# EAGLE design ardustatversion10 (EAGLE 6.1)
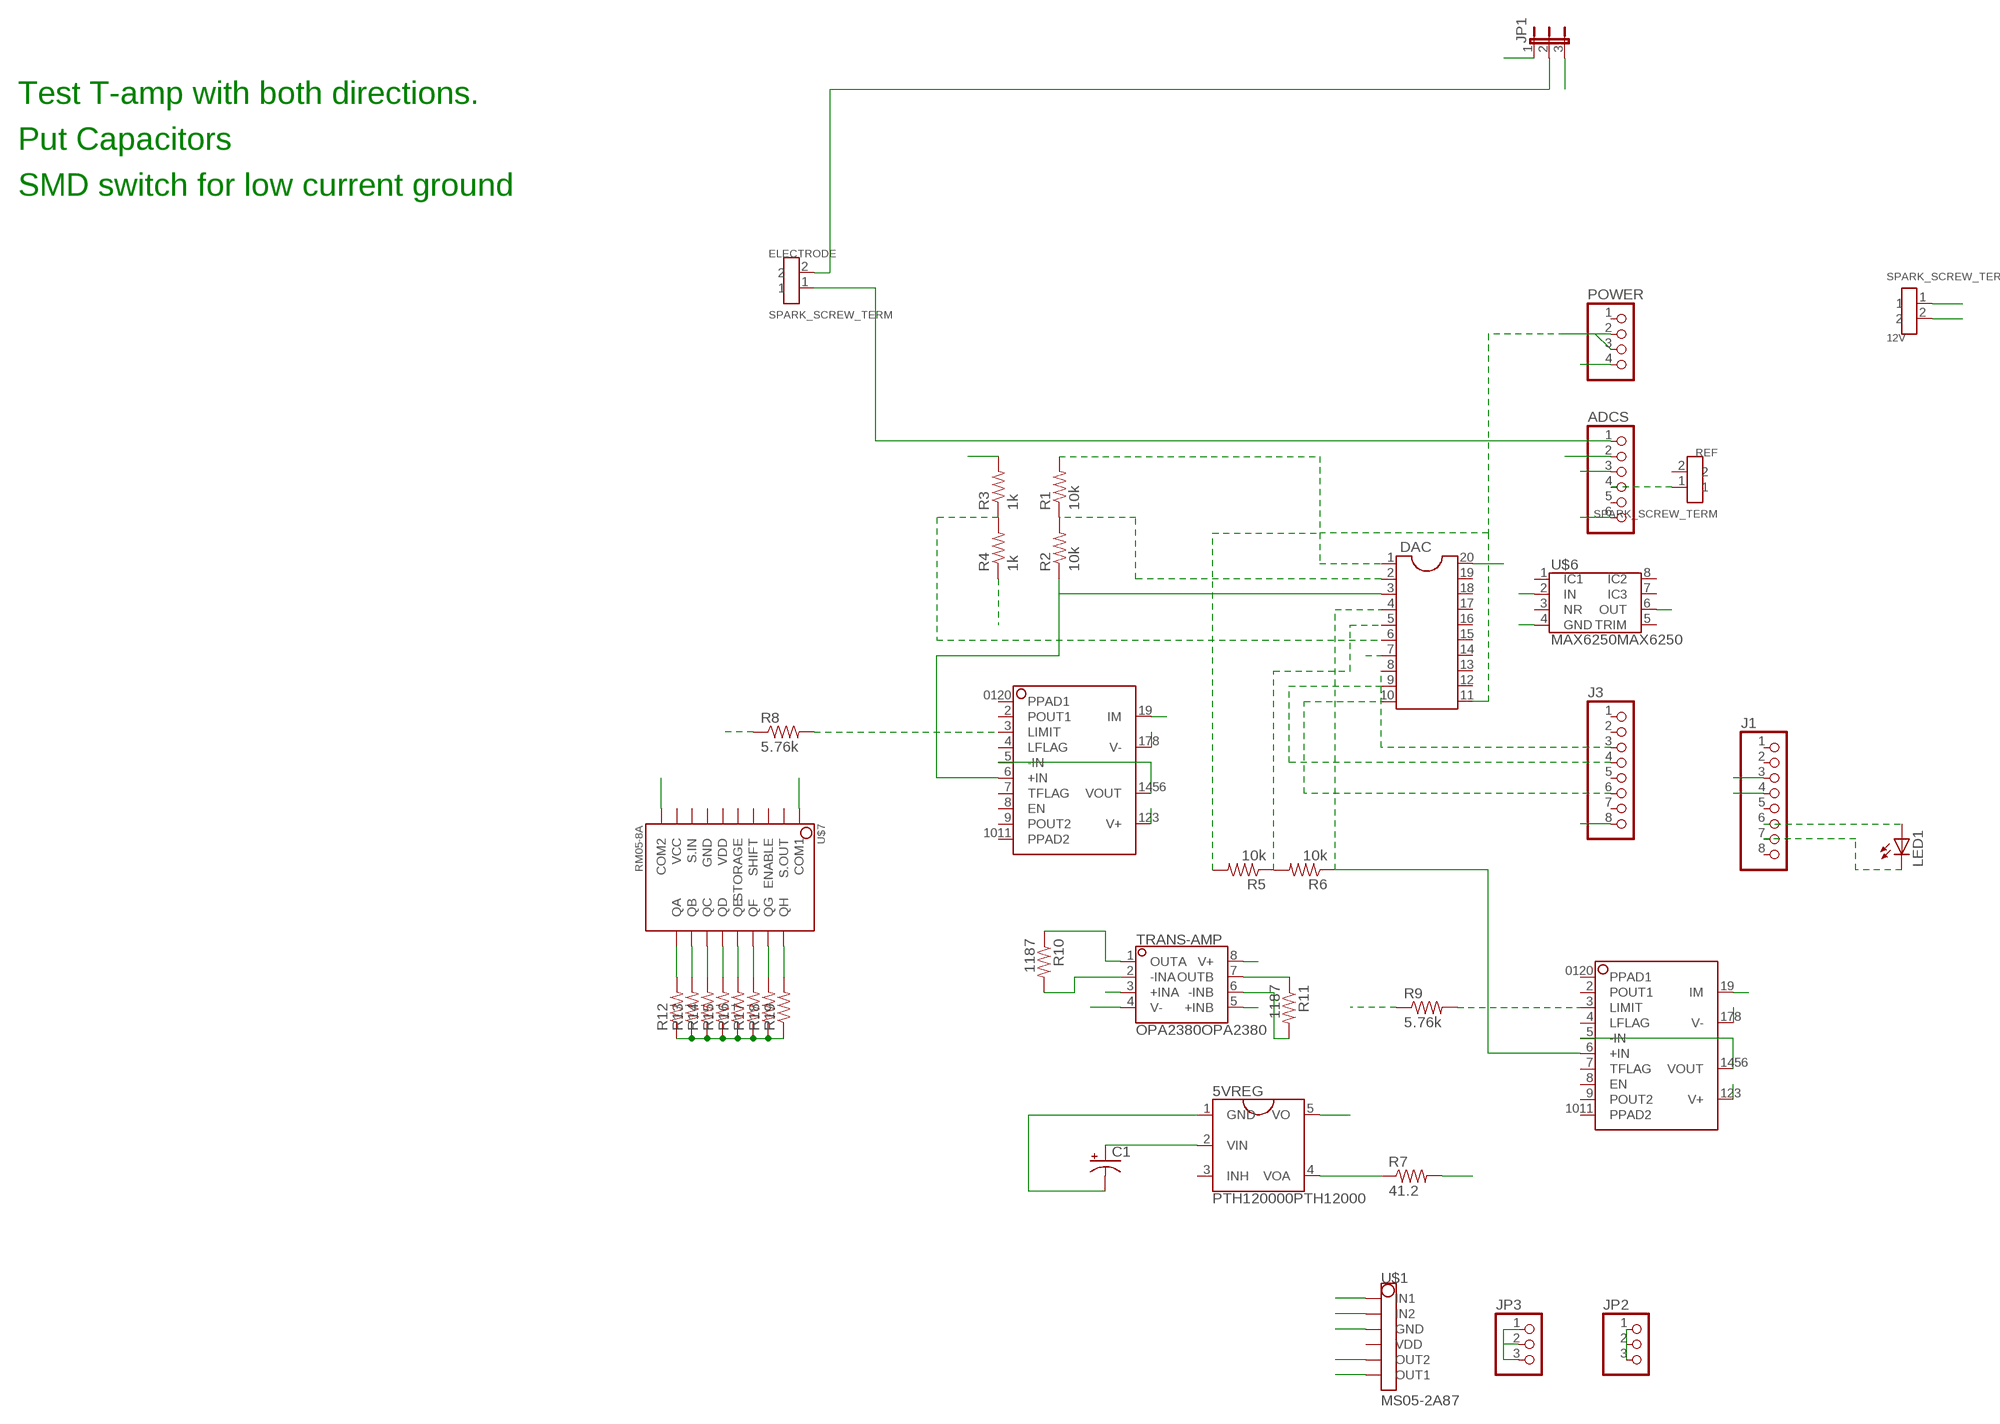
[diagram p0: schematic, sheet 1]

## Parts
5VREG  PTH120000PTH12000  [PTH120000]
12V  SPARK_SCREW_TERM  [SPARK_SCREW_TERM]
ADCS  PINHD-1X6  [1X06]
C1  CPOL-USE5-10.5  [E5-10,5]
DAC  DIL20S  [SOCKED-20]
ELECTRODE  SPARK_SCREW_TERM  [SPARK_SCREW_TERM]
J1  PINHD-1X8  [1X08]
J3  PINHD-1X8  [1X08]
JP1  JP2E  [JP2]
JP2  PINHD-1X3  [1X03]
JP3  PINHD-1X3  [1X03]
LED1  LED5MM  [LED5MM]
POWER  PINHD-1X4  [1X04]
R1  10k  R-US_R1206  [R1206]
R2  10k  R-US_R1206  [R1206]
R3  1k  R-US_R1206  [R1206]
R4  1k  R-US_R1206  [R1206]
R5  10k  R-US_R1206  [R1206]
R6  10k  R-US_R1206  [R1206]
R7  41.2  R-US_M1206  [M1206]
R8  5.76k  R-US_R1206  [R1206]
R9  5.76k  R-US_M1206  [M1206]
R10  1187  R-US_M1206  [M1206]
R11  1187  R-US_M1206  [M1206]
R12  R-US_0207/12  [0207/12]
R13  R-US_0207/12  [0207/12]
R14  R-US_0207/12  [0207/12]
R15  R-US_0207/12  [0207/12]
R16  R-US_0207/12  [0207/12]
R17  R-US_0207/12  [0207/12]
R18  R-US_0207/12  [0207/12]
R19  R-US_0207/12  [0207/12]
REF  SPARK_SCREW_TERM  [SPARK_SCREW_TERM]
TRANS-AMP  OPA2380OPA2380  [OPA2380]
U$1  MS05-2A87  [MS05-2A87]
U$3  OPA569OPA569  [OPA569]
U$4  OPA569OPA569  [OPA569]
U$6  MAX6250MAX6250  [MAX6250]
U$7  RM05-8A  [RM05-8A]

## Nets
GND: 5VREG.1(GND) 12V.2 C1.- DAC.1 DAC.11 JP1.3 POWER.2 POWER.3 R1.2 R4.1 R5.2 R7.2 R8.1 R9.1 TRANS-AMP.4(V-) U$1.P$3(GND) U$3.178(V-) U$4.178(V-) U$6.4(GND)
N$1: DAC.6 R3.1 R4.2
N$2: DAC.10 J3.6
N$3: DAC.9 J3.4
N$4: DAC.8 J3.3
N$5: DAC.7 J1.3
N$6: J1.4
N$7: DAC.2 R1.1 R2.2
N$8: ADCS.1 ELECTRODE.1 JP2.1 JP2.2 JP2.3 R12.1 R13.1 R14.1 R15.1 R16.1 R17.1 R18.1 R19.1
N$9: U$1.P$2(IN2) U$4.5(-IN) U$4.1456(VOUT)
N$10: R10.2 TRANS-AMP.2(-INA) U$3.19(IM)
N$11: R12.2 U$7.P$11(QA)
N$12: DAC.5 R5.1 R6.2
N$13: R8.2 U$3.3(LIMIT)
N$14: R10.1 TRANS-AMP.1(OUTA)
N$15: ADCS.2 DAC.3 R2.1 U$3.6(+IN) U$7.P$1(COM1) U$7.P$10(COM2)
N$16: R9.2 U$4.3(LIMIT)
N$17: J1.6 LED1.A
N$18: J1.7 LED1.K(C)
N$19: 5VREG.5(VO) DAC.20 TRANS-AMP.8(V+) U$3.123(V+) U$4.123(V+)
N$20: ADCS.4 REF.1
N$21: ADCS.3 ELECTRODE.2 JP1.2
N$22: 5VREG.2(VIN) 12V.1 C1.+ POWER.4 U$6.2(IN)
N$23: JP3.1 JP3.2 JP3.3 U$1.P$6(OUT1)
N$24: J3.8 R3.2 TRANS-AMP.3(+INA) TRANS-AMP.5(+INB) U$6.6(OUT)
N$25: 5VREG.4(VOA) R7.1
N$26: U$1.P$1(IN1) U$3.5(-IN) U$3.1456(VOUT)
N$27: R13.2 U$7.P$12(QB)
N$28: R14.2 U$7.P$13(QC)
N$30: R15.2 U$7.P$14(QD)
N$31: R16.2 U$7.P$15(QE)
N$32: DAC.4 R6.1 U$4.6(+IN)
N$33: R17.2 U$7.P$16(QF)
N$34: R18.2 U$7.P$17(QG)
N$35: R19.2 U$7.P$18(QH)
N$36: JP1.1 U$1.P$5(OUT2)
N$48: ADCS.6 R11.1 TRANS-AMP.7(OUTB)
N$49: R11.2 TRANS-AMP.6(-INB) U$4.19(IM)
Unconnected: 5VREG.3(INH) ADCS.5 DAC.12 DAC.13 DAC.14 DAC.15 DAC.16 DAC.17 DAC.18 DAC.19 J1.1 J1.2 J1.5 J1.8 J3.1 J3.2 J3.5 J3.7 POWER.1 REF.2 U$1.P$4(VDD) U$3.2(POUT1) U$3.4(LFLAG) U$3.7(TFLAG) U$3.8(EN) U$3.9(POUT2) U$3.0120(PPAD1) U$3.1011(PPAD2) U$4.2(POUT1) U$4.4(LFLAG) U$4.7(TFLAG) U$4.8(EN) U$4.9(POUT2) U$4.0120(PPAD1) U$4.1011(PPAD2) U$6.1(IC1) U$6.3(NR) U$6.5(TRIM) U$6.7(IC3) U$6.8(IC2) U$7.P$2(S.OUT) U$7.P$3(ENABLE) U$7.P$4(SHIFT) U$7.P$5(STORAGE) U$7.P$6(VDD) U$7.P$7(GND) U$7.P$8(S.IN) U$7.P$9(VCC)

## Notes on the sheet
- Test T-amp with both directions.
- Put Capacitors
- SMD switch for low current ground

## Library data of the parts
5VREG = ardustat:PTH120000
12V ELECTRODE REF = ardustat:SPARK_SCREW_TERM
ADCS = pinhead:PINHD-1X6: PIN HEADER
C1 = rcl:CPOL-US: POLARIZED CAPACITOR, American symbol
DAC = ic-package:DIL20: Dual In Line
J1 J3 = pinhead:PINHD-1X8: PIN HEADER
JP1 = jumper:JP2E: JUMPER
JP2 JP3 = pinhead:PINHD-1X3: PIN HEADER
LED1 = led:LED: LED OSRAM: - CHIPLED LG R971, LG N971, LY N971, LG Q971, LY Q971, LO R971, LY R971 LH N974, LH R974 LS Q976, LO Q976, LY Q976 LO Q996 - Hyper CHIPLED LW Q18S LB Q993, LB Q99A, LB R99A - SideLED LS A670, LO A670, LY A670, LG A670, LP A670 LB A673, LV A673, LT A673, LW A673 LH A674 LY A675 LS A676, LA A676, LO A676, LY A676, LW A676 LS A679, LY A679, LG A679 - Hyper Micro SIDELED® LS Y876, LA Y876, LO Y876, LY Y876 LT Y87S - SmartLED LW L88C, LW L88S LB L89C, LB L89S, LG L890 LS L89K, LO L89K, LY L89K LS L896, LA L896, LO L896, LY L896 - TOPLED LS T670, LO T670, LY T670, LG T670, LP T670 LSG T670, LSP T670, LSY T670, LOP T670, LYG T670 LG T671, LOG T671, LSG T671 LB T673, LV T673, LT T673, LW T673 LH T674 LS T676, LA T676, LO T676, LY T676, LB T676, LH T676, LSB T676, LW T676 LB T67C, LV T67C, LT T67C, LS T67K, LO T67K, LY T67K, LW E67C LS E67B, LA E67B, LO E67B, LY E67B, LB E67C, LV E67C, LT E67C LW T67C LS T679, LY T679, LG T679 LS T770, LO T770, LY T770, LG T770, LP T770 LB T773, LV T773, LT T773, LW T773 LH T774 LS E675, LA E675, LY E675, LS T675 LS T776, LA T776, LO T776, LY T776, LB T776 LHGB T686 LT T68C, LB T68C - Hyper Mini TOPLED® LB M676 - Mini TOPLED Santana® LG M470 LS M47K, LO M47K, LY M47K Source: http://www.osram.convergy.de - LUMILED® LXK2-PW12-R00, LXK2-PW12-S00, LXK2-PW14-U00, LXK2-PW14-V00 LXK2-PM12-R00, LXK2-PM12-S00, LXK2-PM14-U00 LXK2-PE12-Q00, LXK2-PE12-R00, LXK2-PE12-S00, LXK2-PE14-T00, LXK2-PE14-U00 LXK2-PB12-K00, LXK2-PB12-L00, LXK2-PB12-M00, LXK2-PB14-N00, LXK2-PB14-P00, LXK2-PB14-Q00 LXK2-PR12-L00, LXK2-PR12-M00, LXK2-PR14-Q00, LXK2-PR14-R00 LXK2-PD12-Q00, LXK2-PD12-R00, LXK2-PD12-S00 LXK2-PH12-R00, LXK2-PH12-S00 LXK2-PL12-P00, LXK2-PL12-Q00, LXK2-PL12-R00 Source: www.luxeon.com
POWER = pinhead:PINHD-1X4: PIN HEADER
R1 R3-R11 = rcl:R-US_: RESISTOR, American symbol
R2 R12-R19 = resistor:R-US_: RESISTOR, American symbol
TRANS-AMP = ardustat:OPA2380
U$1 = ardustat:MS05-2A87
U$3 U$4 = ardustat:OPA569
U$6 = ardustat:MAX6250
U$7 = ardustat:RM05-8A

## Board
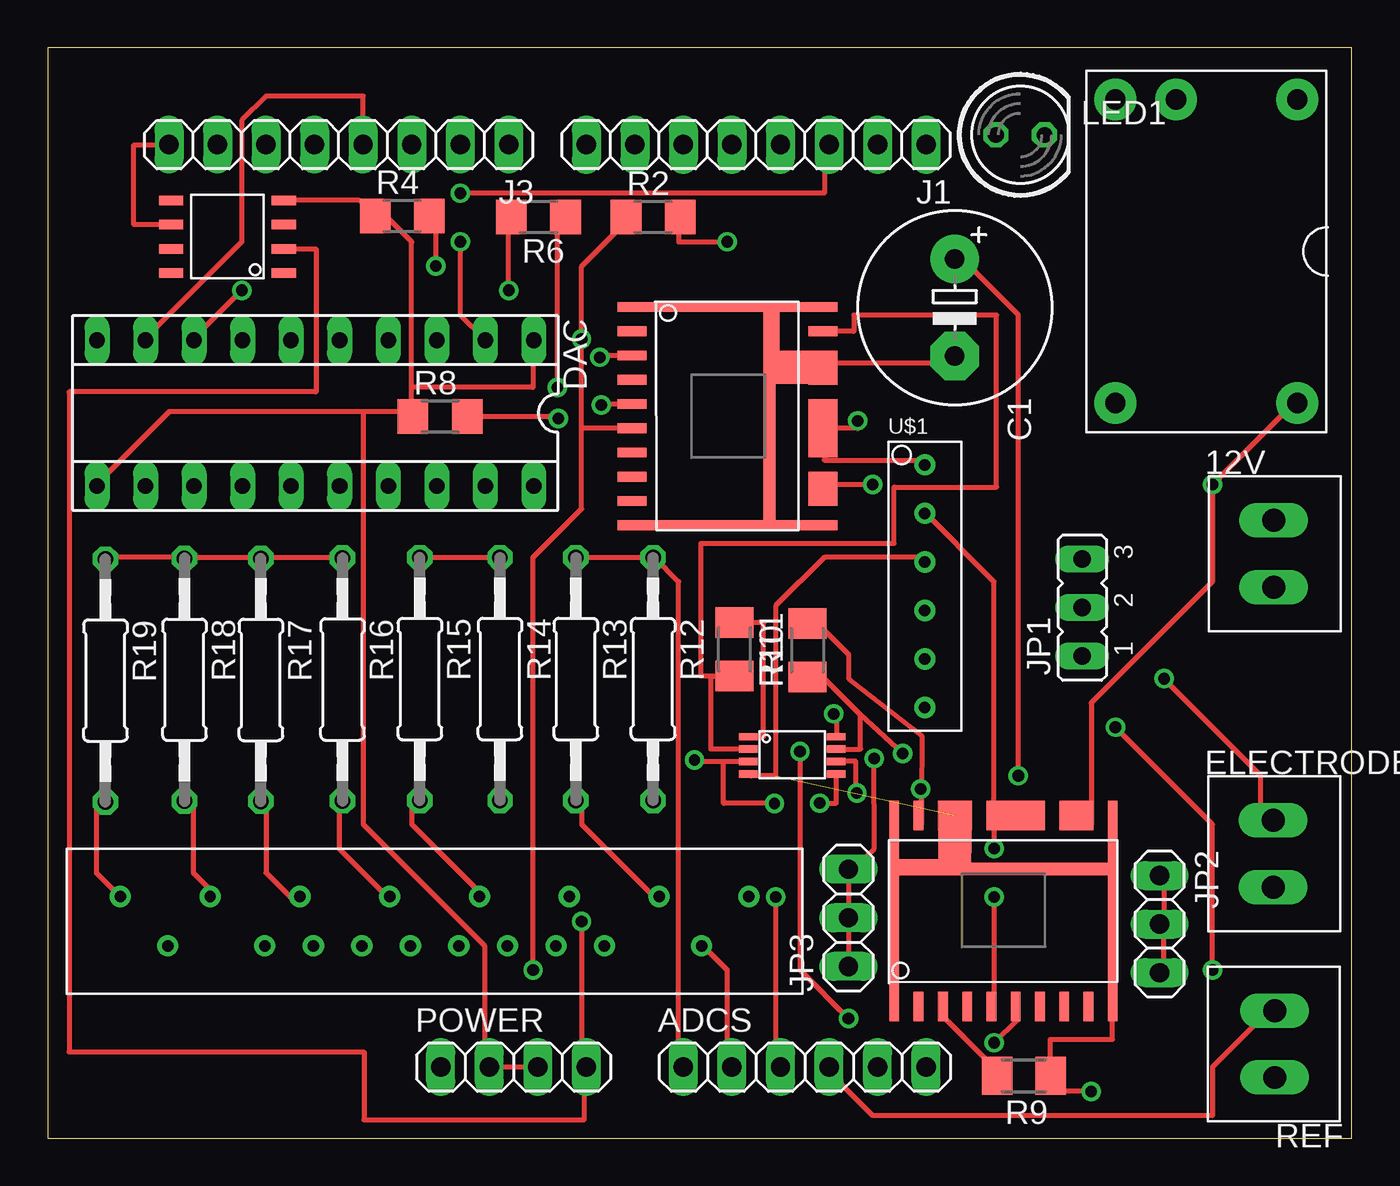
[diagram p1: board, top side]
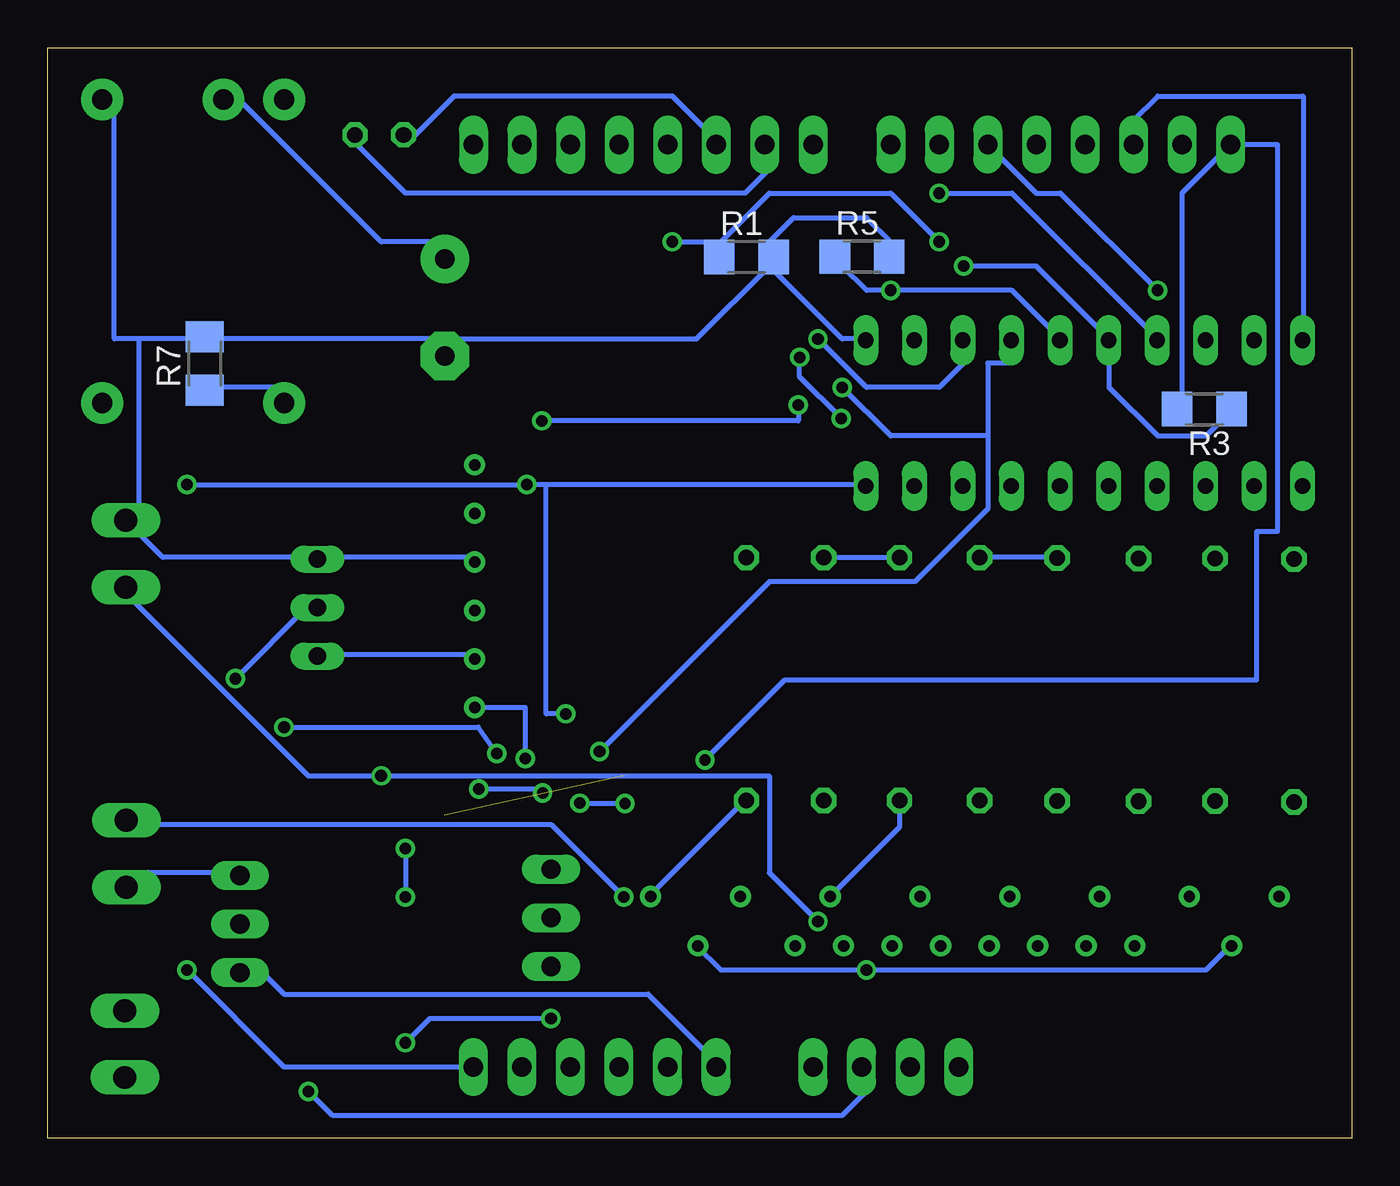
[diagram p2: board, bottom side, seen from below]

Size 68.25 x 57.05 mm. Coordinates in mm from the lower left corner, seen from the top.
Outline: 0,0 68.25,0 68.25,57.05 0,57.05 0,0
Copper layers (1*16): Top 0.035mm / dielectric 1.5mm / Bottom 0.035mm
Design rules: minimum track width 10mil, minimum drill 24mil, track to track 8mil, track to pad 8mil, pad to pad 8mil, via to via 8mil, smd to smd 8mil, copper to edge 40mil, drill to drill 8mil, minimum pad ring 10mil, minimum via ring 8mil, stop-mask expansion 4mil, vias tented up to drill 0mil, thermal gap 0mil

### Footprints (pad centres in the part's own frame; a part is rotated, then mirrored left to right if it is on the bottom)
PTH120000 = drill 1.06 pad 2.184: 1 -7.94,4.76; 2 -7.94,-1.59; 3 -7.94,-4.76; 4 7.94,-4.76; 5 7.94,4.76
SPARK_SCREW_TERM = drill 1.2 long: 1 0,-1.8; 2 0,1.7
1X06 = drill 1.016 long: 1 -6.35,0; 2 -3.81,0; 3 -1.27,0; 4 1.27,0; 5 3.81,0; 6 6.35,0
E5-10,5 = drill 1.016 pad 2.54: + -2.54,0 | drill 1.016 pad 2.54 octagon: - 2.54,0
SOCKED-20 = drill 0.813 long: 1 -11.43,-3.81; 2 -8.89,-3.81; 3 -6.35,-3.81; 4 -3.81,-3.81; 5 -1.27,-3.81; 6 1.27,-3.81; 7 3.81,-3.81; 8 6.35,-3.81; 9 8.89,-3.81; 10 11.43,-3.81; 11 11.43,3.81; 12 8.89,3.81; 13 6.35,3.81; 14 3.81,3.81; 15 1.27,3.81; 16 -1.27,3.81; 17 -3.81,3.81; 18 -6.35,3.81; 19 -8.89,3.81; 20 -11.43,3.81
1X08 = drill 1.016 long: 1 -8.89,0; 2 -6.35,0; 3 -3.81,0; 4 -1.27,0; 5 1.27,0; 6 3.81,0; 7 6.35,0; 8 8.89,0
JP2 = drill 0.914 long: 1 -2.54,0; 2 0,0; 3 2.54,0
1X03 = drill 1.016 long: 1 -2.54,0; 2 0,0; 3 2.54,0
LED5MM = drill 0.813 octagon: A -1.27,0; K 1.27,0
1X04 = drill 1.016 long: 1 -3.81,0; 2 -1.27,0; 3 1.27,0; 4 3.81,0
R1206 = smd 1.6 x 1.803: 1 -1.422,0; 2 1.422,0
M1206 = smd 1.6 x 2: 1 -1.4,0; 2 1.4,0
0207/12 = drill 0.813 octagon: 1 -6.35,0; 2 6.35,0
OPA2380 = smd 0.975 x 0.38: 1 -2.259,0.982; 2 -2.259,0.332; 3 -2.259,-0.318; 4 -2.259,-0.968; 5 2.351,-0.968; 6 2.351,-0.318; 7 2.351,0.332; 8 2.351,0.982
MS05-2A87 = drill 0.6: P$1 0,6.35; P$2 0,3.81; P$3 0,1.27; P$4 0,-1.27; P$5 0,-3.81; P$6 0,-6.35
OPA569 = smd 1.53 x 0.51: 2 -5,4.343; 3 -5,3.073; 4 -5,1.803; 5 -5,0.533; 6 -5,-0.737; 7 -5,-2.007; 8 -5,-3.277; 9 -5,-4.547; 19 5,4.343 | smd 11.53 x 0.51: 0120 0,5.613; 1011 0,-5.817 | smd 1.53 x 1.781: 123 5,-3.913; 178 5,2.438 | smd 1.53 x 3.051: 1456 5,-0.738 | smd 1.27 x 0.635: P$1 3.66,2.99; P$2 3.66,2.4; P$3 3.66,1.9; P$4 2.61,2.99; P$5 2.61,2.58; P$6 2.61,2.08; P$7 2.61,1.94; P$8 2.61,1.92 | smd 0.635 x 1.27: P$9 2.2,3.54; P$10 2.2,4.04; P$11 2.2,4.79; P$12 2.4,4.94; P$13 2.4,4.35; P$14 2.4,3.89; P$15 2.2,3.08; P$16 2.2,2.6; P$17 2.2,2.21; P$18 2.2,1.18; P$19 2.2,0.04; P$20 2.2,-1.03; P$21 2.2,-2.18; P$22 2.2,-3.36; P$23 2.2,-4.54; P$24 2.2,-5.28
MAX6250 = smd 1.27 x 0.49: 1 -3.012,1.903; 2 -3.012,0.633; 3 -3.012,-0.637; 4 -3.012,-1.907; 5 2.888,-1.907; 6 2.888,-0.637; 7 2.888,0.633; 8 2.888,1.903
RM05-8A = drill 0.6: P$1 -1.29,13.97; P$2 -1.29,8.89; P$3 -1.29,6.35; P$4 -1.29,3.81; P$5 -1.29,1.27; P$6 -1.29,-1.27; P$7 -1.29,-3.81; P$8 -1.29,-6.35; P$9 -1.29,-8.89; P$10 -1.29,-13.97; P$11 1.29,-16.45; P$12 1.29,-11.75; P$13 1.29,-7.05; P$14 1.29,-2.35; P$15 1.29,2.35; P$16 1.29,7.05; P$17 1.29,11.75; P$18 1.29,16.45

### Placement (x,y rotation side)
5VREG  60.64,46.4 270 top
12V  64.17,30.63 0 top
ADCS  39.62,3.72 0 top
C1  47.47,43.45 270 top
DAC  14.01,37.93 180 top
ELECTRODE  64.14,14.93 0 top
J1  37.08,51.97 180 top
J3  15.24,51.98 180 top
JP1  54.14,27.76 90 top
JP2  58.19,11.19 270 top
JP3  41.91,11.53 90 top
LED1  50.9,52.49 0 top
POWER  24.38,3.71 0 top
R1  31.68,46.1 0 bottom
R2  31.69,48.19 0 top
R3  7.72,38.14 180 bottom
R4  18.56,48.24 0 top
R5  25.63,46.11 0 bottom
R6  25.68,48.2 180 top
R7  60.03,40.53 90 bottom
R8  20.54,37.75 0 top
R9  51.1,3.26 180 top
R10  35.95,25.57 270 top
R11  39.76,25.52 90 top
R12  31.68,24.02 270 top
R13  27.64,24.01 270 top
R14  23.67,24.02 270 top
R15  19.47,24.01 270 top
R16  15.43,23.99 270 top
R17  11.15,23.97 270 top
R18  7.16,23.98 270 top
R19  3.02,23.94 270 top
REF  64.22,4.87 180 top
TRANS-AMP  38.92,20.02 0 top
U$1  45.91,28.87 0 top
U$3  35.58,37.87 0 top
U$4  49.92,11.88 90 top
U$6  9.35,47.16 180 top
U$7  20.25,11.35 90 top

### Tracks (layer width: path | path; a pad name or v marks a point on that pad's centre or on a via)
GND  (via drill 0.61)  (1 unrouted)
  Top 0.254: TRANS-AMP.4 36.83,18.96 38.1,18.96 38.1,27.85 40.64,30.39 45.72,30.39 U$1.P$3 | v54.61,2.45 52.07,2.45 R9.1 | 22.86,3.72 25.4,3.72 POWER.3 | 19.05,38.01 19.05,39.28 | 19.05,39.28 19.05,46.9 17.78,48.17 R4.1 16.32,49.06 U$6.4 | 19.05,38.01 16.51,38.01 | 16.51,38.01 6.35,38.01 2.54,34.2 DAC.11 | 19.05,38.01 R8.1 | U$3.178 40.64,40.55 46.99,40.55 C1.- | 19.05,39.28 25.4,39.28 25.4,40.55 DAC.1 | 22.86,3.72 22.86,10.07 16.51,16.42 16.51,38.01 | 22.86,3.72 POWER.2
  Bottom 0.254: U$1.P$3 45.72,30.39 53.34,30.39 JP1.3 54.61,30.39 62.23,30.39 63.5,31.66 12V.2 63.5,32.93 63.5,41.82 | v54.61,2.45 53.34,1.18 26.67,1.18 25.4,2.45 POWER.3 | 30.48,45.63 26.67,41.82 25.4,41.82 DAC.1 | R5.2 24.13,46.9 25.4,48.17 29.21,48.17 30.48,46.9 R1.2 30.48,45.63 | 63.5,41.82 60.96,41.82 R7.2 59.69,41.82 48.26,41.82 C1.- 46.99,41.82 34.29,41.82 30.48,45.63 | 63.5,41.82 64.77,41.82 64.77,54.52 5VREG.1
N$1  (via drill 0.61)
  Top 0.254: v20.32,45.63 20.32,48.17 R4.2
  Bottom 0.254: R3.1 6.35,38.01 7.62,36.74 10.16,36.74 12.7,39.28 12.7,40.55 DAC.6 12.7,41.82 16.51,45.63 v20.32,45.63
N$2
  Bottom 0.254: DAC.10 2.54,41.82 2.54,54.52 10.16,54.52 11.43,53.25 J3.6
N$3
  Top 0.254: DAC.9 5.08,41.82 10.16,46.9 10.16,53.25 11.43,54.52 16.51,54.52 16.51,53.25 J3.4
N$4  (via drill 0.61)
  Top 0.254: v10.16,44.36 7.62,41.82 DAC.8
  Bottom 0.254: v10.16,44.36 15.24,49.44 16.51,49.44 J3.3
N$5  (via drill 0.61)
  Top 0.254: v21.59,49.44 40.64,49.44 40.64,50.71 J1.3
  Bottom 0.254: v21.59,49.44 17.78,49.44 10.16,41.82 DAC.7
N$7  (via drill 0.61)
  Top 0.254: v35.56,46.9 33.02,46.9 33.02,48.17 R2.2 | v21.59,46.9 21.59,43.09 22.86,41.82 DAC.2
  Bottom 0.254: v35.56,46.9 33.02,46.9 | v21.59,46.9 24.13,49.44 30.48,49.44 33.02,46.9 | 33.02,46.9 R1.1
N$8
  Top 0.254: 31.75,30.39 27.94,30.39 R13.1 | 7.62,30.39 2.54,30.39 R19.1 | 7.62,30.39 11.43,30.39 | 7.62,30.39 R18.1 | 11.43,30.39 15.24,30.39 R16.1 | 11.43,30.39 R17.1 | R14.1 24.13,30.39 19.05,30.39 R15.1 | 58.42,11.34 58.42,13.88 JP2.1 | 58.42,11.34 58.42,8.8 JP2.3 | 58.42,11.34 JP2.2 | 31.75,30.39 33.02,29.12 33.02,3.72 ADCS.1 | 31.75,30.39 R12.1
  Bottom 0.254: R14.1 24.13,30.39 27.94,30.39 R13.1 | R15.1 19.05,30.39 15.24,30.39 R16.1 | ELECTRODE.1 63.5,13.88 58.42,13.88 JP2.1 | ADCS.1 33.02,3.72 36.83,7.53 55.88,7.53 57.15,8.8 JP2.3
N$9  (via drill 0.61)
  Top 0.254: v49.53,12.61 49.53,7.53 U$4.5 | 49.53,16.42 v49.53,15.15 | 49.53,16.42 49.53,29.12 45.72,32.93 U$1.P$2 | 49.53,16.42 U$4.1456
  Bottom 0.254: v49.53,15.15 v49.53,12.61
N$10
  Top 0.254: TRANS-AMP.2 34.7,20.35 34.7,24.16 R10.2 34.19,24.17 34.19,31.11 44.29,31.11 44.29,34.06 49.65,34.06 49.65,43.05 42.19,43.05 42.19,42.21 U$3.19
N$11
  Bottom 0.254: U$7.P$11 36.83,12.61 31.75,17.69 R12.2
N$12  (via drill 0.61)
  Top 0.254: v24.13,44.36 24.13,48.17 R6.2
  Bottom 0.254: R5.1 26.67,45.63 25.4,44.36 v24.13,44.36 17.78,44.36 15.24,41.82 DAC.5
N$13  (via drill 0.6)
  Top 0.254: v28.9,40.85 28.9,40.95 U$3.3 | v26.72,37.65 26.62,37.75 R8.2
  Bottom 0.254: v26.72,37.65 28.9,39.83 v28.9,40.85
N$14
  Top 0.254: TRANS-AMP.1 37.47,21 37.47,26.96 R10.1
N$15  (via drill 0.61)
  Top 0.254: R2.1 30.48,48.17 27.94,45.63 v27.94,41.82 27.94,37.14 | ADCS.2 35.56,3.72 35.56,8.8 34.29,10.07 U$7.P$10 | v25.4,8.8 25.4,30.39 27.94,32.93 27.94,37.1 27.94,37.14 | U$3.6 27.94,37.14
  Bottom 0.254: v27.94,41.82 25.4,39.28 21.59,39.28 20.32,40.55 DAC.3 | U$7.P$1 6.35,10.07 7.62,8.8 v25.4,8.8 33.02,8.8 34.29,10.07 U$7.P$10
N$16
  Top 0.254: U$4.3 46.99,6.26 49.53,3.72 R9.2
N$17
  Bottom 0.254: LED1.A 49.53,51.98 46.99,54.52 35.56,54.52 33.02,51.98 J1.6
N$18
  Bottom 0.254: LED1.K 52.07,51.98 49.53,49.44 31.75,49.44 30.48,50.71 J1.7
N$19  (via drill 0.6, 0.61)
  Top 0.254: v43.18,34.2 40.64,34.2 U$3.123 | U$4.123 54.61,16.42 54.61,22.77 60.96,29.12 v60.96,34.2 64.77,38.01 5VREG.5 | v41.14,22.2 41.27,22.2 TRANS-AMP.8
  Bottom 0.254: 42.16,34.2 25.4,34.2 DAC.20 | 42.16,34.2 v43.18,34.2 v60.96,34.2 | v41.14,22.2 42.16,22.2 42.16,34.2
N$20
  Top 0.254: ADCS.4 40.64,3.72 43.18,1.18 60.96,1.18 60.96,3.72 63.5,6.26 REF.1
N$21  (via drill 0.61)
  Top 0.254: v58.42,24.04 63.5,18.96 63.5,16.42 ELECTRODE.2 | v38.1,12.61 38.1,3.72 ADCS.3
  Bottom 0.254: v58.42,24.04 54.61,27.85 JP1.2 | v38.1,12.61 41.91,16.42 63.5,16.42 ELECTRODE.2
N$22  (via drill 0.61)
  Top 0.254: v27.94,11.34 27.94,3.72 | 27.94,3.72 POWER.4 | v50.8,18.96 50.8,43.09 48.26,45.63 C1.+ | U$6.2 14.04,46.52 14.04,39.04 1.12,39.04 1.12,4.51 16.55,4.51 16.55,0.96 28.06,0.96 28.06,3.72 27.94,3.72
  Bottom 0.254: 5VREG.2 58.42,54.52 50.8,46.9 48.26,46.9 C1.+ | v27.94,11.34 30.48,13.88 30.48,18.96 v50.8,18.96 54.61,18.96 64.77,29.12 12V.1
N$23  (via drill 0.61)
  Top 0.254: 41.91,11.34 41.91,8.8 JP3.1 | v43.25,19.86 43.26,15.14 41.91,13.88 | 41.91,13.88 41.91,11.34 | 41.91,11.34 JP3.2 | 41.91,13.88 JP3.3
  Bottom 0.254: v43.25,19.86 43.25,22.53 U$1.P$6
N$24  (via drill 0.6)
  Top 0.254: U$6.6 4.5,47.79 4.5,51.96 6.34,51.96 J3.8 | v40.41,17.52 41.27,17.52 TRANS-AMP.5 | v38.03,17.51 35.38,17.51 35.38,19.7 | 35.38,19.7 TRANS-AMP.3 | v33.85,19.79 33.93,19.7 35.38,19.7
  Bottom 0.254: R3.2 8.89,38.01 8.89,49.44 J3.8 3.88,51.98 3.88,31.75 4.98,31.75 4.98,23.97 29.67,23.97 v33.85,19.79 | v40.41,17.52 38.03,17.52 v38.03,17.51
N$25
  Bottom 0.254: R7.1 59.69,39.28 55.88,39.28 5VREG.4
N$26  (via drill 0.6)
  Top 0.254: U$1.P$1 45.72,35.47 40.64,35.47 40.64,36.74 U$3.1456 42.39,37.14 v42.39,37.53 | v28.97,38.35 28.97,38.41 U$3.5
  Bottom 0.254: v28.97,38.35 28.97,37.53 v42.39,37.53
N$27
  Top 0.254: U$7.P$12 31.75,12.61 27.94,16.42 27.94,17.69 R13.2
N$28
  Bottom 0.254: R14.2 23.67,16.27 U$7.P$13
N$29
  Top 0.254: 52.47,3.29 52.47,5.16 55.73,5.16 55.73,6.62
N$30
  Top 0.254: U$7.P$14 22.86,12.61 19.05,16.42 19.05,17.69 R15.2
N$31
  Top 0.254: U$7.P$15 17.78,12.61 15.24,15.15 15.24,17.69 R16.2
N$32  (via drill 0.61)
  Top 0.254: v49.53,4.99 50.8,6.26 U$4.6 | v41.91,6.26 39.37,8.8 v39.37,20.23 | v26.67,39.28 26.67,48.17 R6.1
  Bottom 0.254: v49.53,4.99 48.26,6.26 v41.91,6.26 | v39.37,20.23 30.48,29.12 22.86,29.12 19.05,32.93 19.05,36.74 | 19.05,36.74 19.05,40.55 17.78,40.55 DAC.4 | v26.67,39.28 24.13,36.74 19.05,36.74
N$33
  Top 0.254: U$7.P$16 12.7,12.61 11.43,13.88 11.43,17.69 R17.2
N$34
  Top 0.254: U$7.P$17 8.89,12.61 7.62,13.88 7.62,17.69 R18.2
N$35
  Top 0.254: U$7.P$18 3.81,12.61 2.54,13.88 2.54,17.69 R19.2
N$36
  Bottom 0.254: U$1.P$5 45.72,25.31 53.34,25.31 JP1.1
N$48  (via drill 0.61)
  Top 0.254: v44.75,20.12 42.55,22.15 | 42.55,22.15 40.64,24.04 R11.1 | v55.88,21.5 60.96,16.42 v60.96,8.8 | TRANS-AMP.7 42.55,20.35 42.55,22.15
  Bottom 0.254: v44.75,20.12 45.72,21.5 v55.88,21.5 | v60.96,8.8 55.88,3.72 ADCS.6 45.72,3.72
N$49  (via drill 0.6)
  Top 0.254: 45.73,17.71 45.74,21.05 41.91,24.04 41.91,25.31 40.64,26.58 R11.2 | 45.73,17.71 45.72,16.42 U$4.19 | v42.35,18.06 42.3,18.06 42.3,19.71 TRANS-AMP.6 | v45.69,18.26 45.73,18.22 45.73,17.71
  Bottom 0.254: v42.35,18.06 42.55,18.26 v45.69,18.26